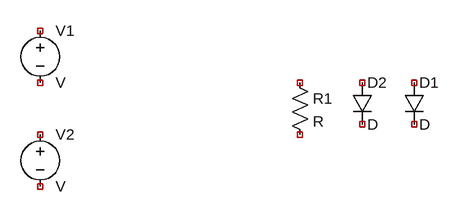
[diagram p0: schematic test_clamping.asc]
test_clamping.asc, the LTspice schematic file:
Version 4
SHEET 1 880 680
SYMBOL diode 224 160 R0
SYMATTR InstName D1
SYMBOL diode 144 160 R0
SYMATTR InstName D2
SYMBOL res 48 144 R0
SYMATTR InstName R1
SYMBOL voltage -336 64 R0
SYMATTR InstName V1
SYMBOL voltage -336 224 R0
SYMATTR InstName V2

The netlist it stands for:
* test_clamping.asc
D1 NC_01 NC_02 D
D2 NC_03 NC_04 D
R1 NC_05 NC_06 R
V1 NC_07 NC_08 V
V2 NC_09 NC_10 V
.model D D
.lib standard.dio
.backanno
.end